# Altium schematic sheet DDATN.schdoc
size A
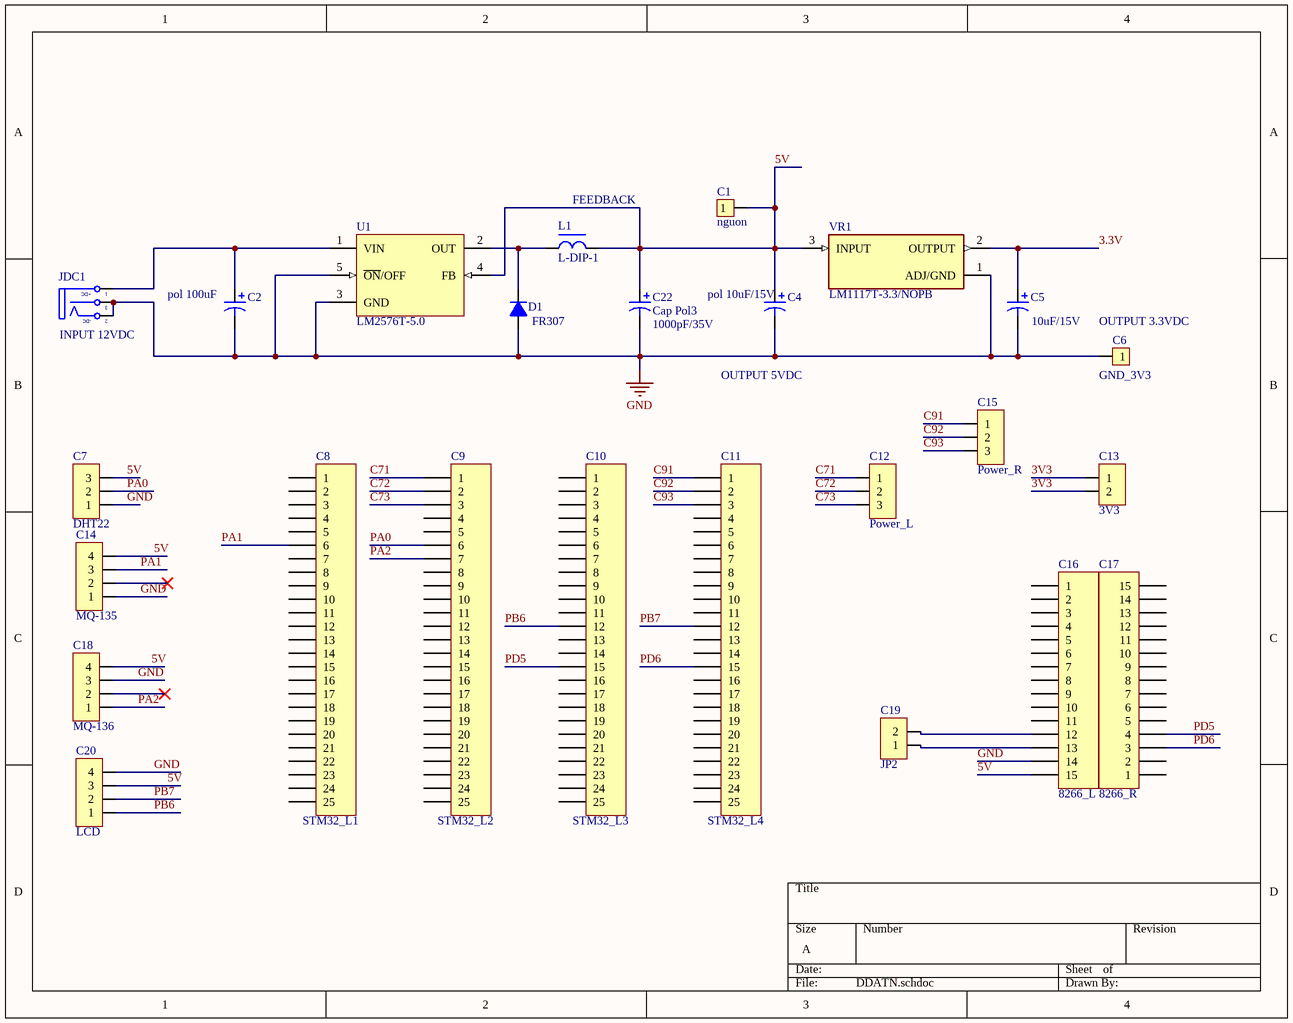
[diagram p0: DDATN.schdoc]

## Parts
C1  nguon  [JP1-D1T]
C2  pol 100uF  [C10mm]
C4  pol 10uF/15V  [C10mm]
C5  10uF/15V  [C10mm]
C6  GND_3V3  [JP1-D1T]
C7  DHT22  [JP3-C1T]
C8  STM32_L1  [JP25-C1T]
C9  STM32_L2  [JP25-C1T]
C10  STM32_L3  [JP25-C1T]
C11  STM32_L4  [JP25-C1T]
C12  Power_L  [JP3-C1T]
C13  3V3  [JP2-C1T]
C14  MQ-135  [JP4-C1T]
C15  Power_R  [JP3-C1T]
C16  8266_L  [JP15-C1T]
C17  8266_R  [JP15-C1T]
C18  MQ-136  [JP4-C1T]
C19  JP2  [JP2-C1T]
C20  LCD  [JP4-C1T]
C22  Cap Pol3  value 1000pF/35V  [CP2/5]
D1  FR307  [D2A]
JDC1  (no value)  [DC-IN]
L1  L-DIP-1  [L-DIP-M-5.3]
U1  LM2576T-5.0  [LM2576t]
VR1  LM1117T-3.3/NOPB  [TO254P1054X470X1955-3]

## Nets
GND: C2.2 C4.2 C5.2 C6.1 C7.1 C14.1 C16.14 C18.3 C20.4 C22.2 D1.1(A) JDC1.2(TN) JDC1.3(S) U1.3(GND) U1.5(~{ON}/OFF) VR1.1(ADJ/GND)
3.3V: C5.1 VR1.2(OUTPUT)
3V3: C13.1 C13.2
5V: C1.1 C4.1 C7.3 C14.4 C16.15 C18.4 C20.3 C22.1 L1.2 U1.4(FB) VR1.3(INPUT)
C71: C9.1 C12.1
C72: C9.2 C12.2
C73: C9.3 C12.3
C91: C11.1 C15.1
C92: C11.2 C15.2
C93: C11.3 C15.3
PA0: C7.2 C9.6
PA1: C8.6 C14.3
PA2: C9.7 C18.1
PB6: C10.12 C20.1
PB7: C11.12 C20.2
PD5: C10.15 C17.4
PD6: C11.15 C17.3
NetC2_1: C2.1 JDC1.1(T) U1.1(VIN)
NetC16_12: C16.12 C19.2
NetC16_13: C16.13 C19.1
NetD1_2: D1.2(K) L1.1 U1.2(OUT)

Not connected (* = marked no-connect by the designer): C8 1 2 3 4 5 7 8 9 10 11 12 13 14 15 16 17 18 19 20 21 22 23 24 25; C9 4 5 8 9 10 11 12 13 14 15 16 17 18 19 20 21 22 23 24 25; C10 1 2 3 4 5 6 7 8 9 10 11 13 14 16 17 18 19 20 21 22 23 24 25; C11 4 5 6 7 8 9 10 11 13 14 16 17 18 19 20 21 22 23 24 25; C14 2*; C16 1 2 3 4 5 6 7 8 9 10 11; C17 1 2 5 6 7 8 9 10 11 12 13 14 15; C18 2*

## Notes on the sheet
- (near L1) FEEDBACK
- (near JDC1) INPUT 12VDC
- (near C6) OUTPUT 3.3VDC
- OUTPUT 5VDC
- (in symbol DCIN) +DC; -DC

## Library data of the parts
C1 C6 = JP1: WR-PHD 2.54 mm Angled Socket Header; Manufacturer: W¨¹rth Elektronik eiSos GmbH; partNo: 613002143121; ComponentLink1 Description: Manufacturer; ComponentLink2 Description: Datasheet; NoPins: 02; Created Date: 29 March 2013; ComponentLink1URL: http://www.we-online.com; ComponentLink2URL: http://katalog.we-online.de/em/datasheet/6130xx143121.pdf; Created by: Karrer Zheng
C2 C4 C5 = Cap Pol 12mm: Polarized Capacitor (Axial); Published: 8-Jun-2000; LatestRevisionDate: 17-Jul-2002; LatestRevisionNote: Re-released for DXP Platform.; PackageReference: POLAR0.8; Publisher: Altium Limited
C7 C12 C15 = JP3: WR-PHD 2.54 mm Angled Socket Header; Manufacturer: W¨¹rth Elektronik eiSos GmbH; partNo: 613003143121; ComponentLink1 Description: Manufacturer; ComponentLink2 Description: Datasheet; NoPins: 03; Created Date: 29 March 2013; ComponentLink1URL: http://www.we-online.com; ComponentLink2URL: http://katalog.we-online.de/em/datasheet/6130xx143121.pdf; Created by: Karrer Zheng
C8-C11 = JP25: WR-PHD 2.54 mm Angled Socket Header; Manufacturer: W¨¹rth Elektronik eiSos GmbH; partNo: 613025143121; ComponentLink1 Description: Manufacturer; ComponentLink2 Description: Datasheet; NoPins: 25; Created Date: 29 March 2013; ComponentLink1URL: http://www.we-online.com; ComponentLink2URL: http://katalog.we-online.de/em/datasheet/6130xx143121.pdf; Created by: Karrer Zheng
C13 C19 = JP2: WR-PHD 2.54 mm Angled Socket Header; Manufacturer: W¨¹rth Elektronik eiSos GmbH; partNo: 613002143121; ComponentLink1 Description: Manufacturer; ComponentLink2 Description: Datasheet; NoPins: 02; Created Date: 29 March 2013; ComponentLink1URL: http://www.we-online.com; ComponentLink2URL: http://katalog.we-online.de/em/datasheet/6130xx143121.pdf; Created by: Karrer Zheng
C14 C18 C20 = JP4: WR-PHD 2.54 mm Angled Socket Header; Manufacturer: W¨¹rth Elektronik eiSos GmbH; partNo: 613004143121; ComponentLink1 Description: Manufacturer; ComponentLink2 Description: Datasheet; NoPins: 04; Created Date: 29 March 2013; ComponentLink1URL: http://www.we-online.com; ComponentLink2URL: http://katalog.we-online.de/em/datasheet/6130xx143121.pdf; Created by: Karrer Zheng
C16 C17 = JP15: WR-PHD 2.54 mm Angled Socket Header; Manufacturer: W¨¹rth Elektronik eiSos GmbH; partNo: 613015143121; ComponentLink1 Description: Manufacturer; ComponentLink2 Description: Datasheet; NoPins: 15; Created Date: 29 March 2013; ComponentLink1URL: http://www.we-online.com; ComponentLink2URL: http://katalog.we-online.de/em/datasheet/6130xx143121.pdf; Created by: Karrer Zheng
C22 = Cap Pol3: Polarized Capacitor (Surface Mount); VALUE: C?; LatestRevisionDate: 17-Jul-2002; LatestRevisionNote: Re-released for DXP Platform.; PackageReference: C0805; Publisher: Altium Limited
D1 = D1A: Diode 1A; Value: 1N4007
JDC1 = DCIN: Jac DC input; Value: Jac DC
L1 = L-DIP-1: Inductor; Value: 150 mH
U1 = LM2576T-5.0: SIMPLE SWITCHER; 3A Step-Down Voltage Regulator; Manufacturer: National Semiconductor; PackageTopMarking: NSUZXYTT*LM2576T*-5.0 P+; PowerWise: N; FirstPublished: 4-Dec-2008; DatasheetVersion: Aug-2004; PackageVersion: revJ, Jan-1992; PackageReference: T05A; Publisher: Altium Limited; PackageDescription: TO-220, Molded, 5 Lead, Straight; CompType: Switcher; PartNumber: LM2576T-5.0; RoHS: O; PinCount: 5; DigiKeyPartNumber: LM2576T-5.0-ND; Code_JEDEC: TO-220-AB; ComponentLink1Description: LM2576 Datasheet; ComponentLink1URL: http://www.national.com/ds/LM/LM2576.pdf; ComponentLink2Description: LM2576 Web Page; ComponentLink2URL: http://www.national.com/pf/LM/LM2576.html; ComponentLink3Description: T05A Package Page; ComponentLink3URL: http://www.national.com/packaging/folders/t05a.html
VR1 = LM1117T-3.3/NOPB: 800-mA 15-V linear voltage regulator 3-TO-220 0 to 125; MF: Texas Instruments; MP: LM1117T-3.3/NOPB; Texas_Instruments-Purchase-URL: https://snapeda.com/shop?store=Texas+Instruments&id=22275; Availability: Warning; Package: TO-220-3 Texas Instruments; DigiKey-Purchase-URL: https://snapeda.com/shop?store=DigiKey&id=22275; Value: *; Mouser-Purchase-URL: https://snapeda.com/shop?store=Mouser&id=22275; SnapEDA_Link: https://www.snapeda.com/parts/LM1117T-3.3/NOPB/Texas%20Instruments/view-part/22275/?ref=snap; Price: None